# EAGLE design BareBones Arduino With Multiplexer (EAGLE 8.7.0)
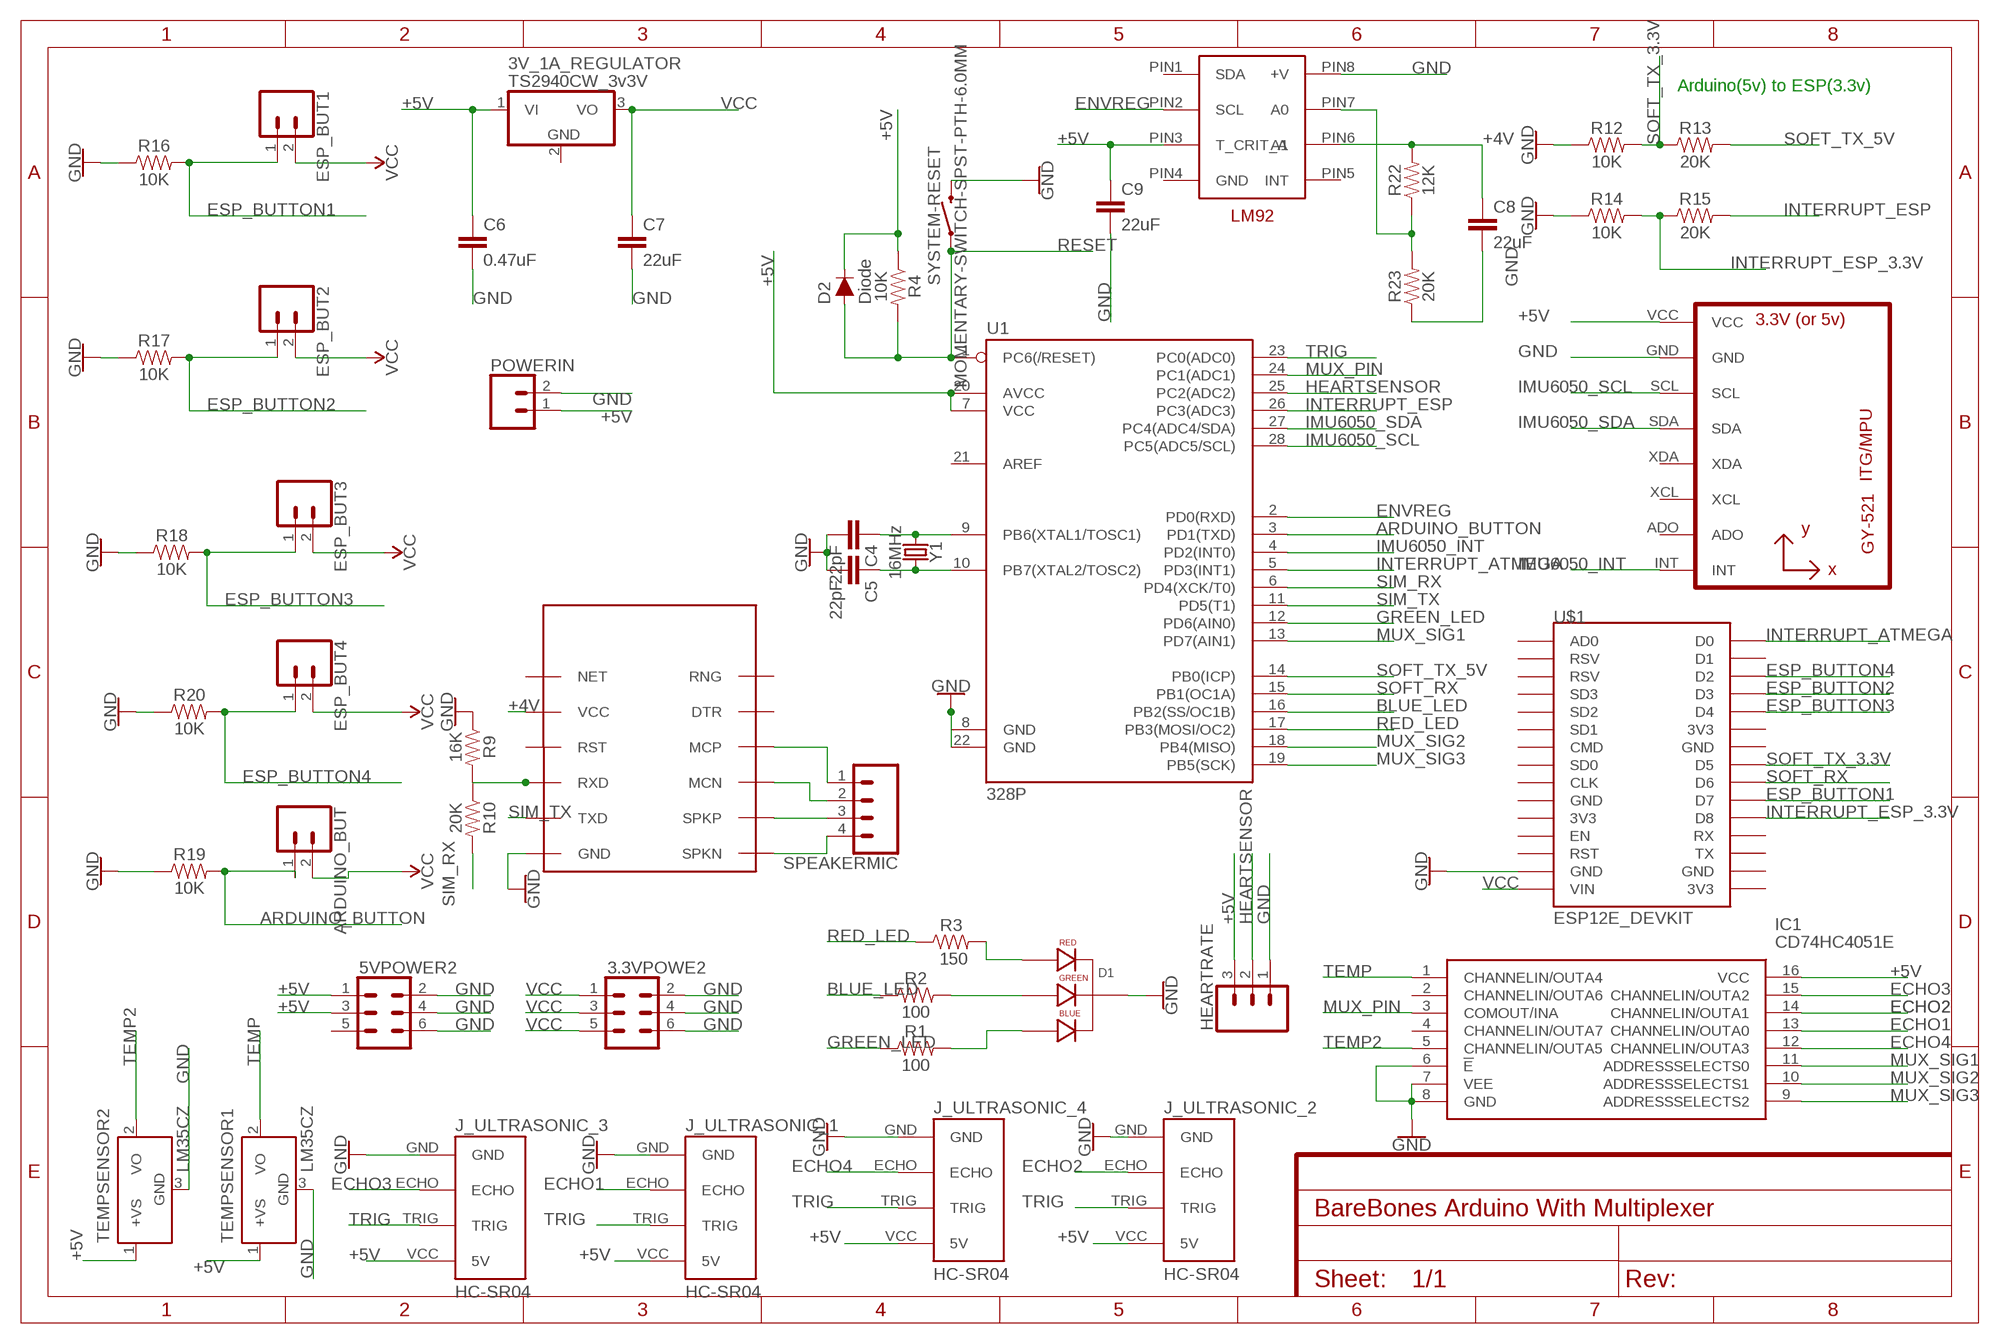
[diagram p0: schematic, sheet 1]

## Parts
3.3VPOWE2  CONN_03X2FEMALE  [2X3]
3V_1A_REGULATOR  TS2940CW_3v3V  MCP1703DB  [SOT223]
5VPOWER2  CONN_03X2FEMALE  [2X3]
ARDUINO_BUT  CONN_02  [1X02]
C4  22pF  22PF-PTH-2.54MM-200V-5%  [CAP-PTH-2.54]
C5  22pF  22PF-PTH-2.54MM-200V-5%  [CAP-PTH-2.54]
C6  0.47uF  0.1UF-KIT-EZ-50V-20%  [CAP-PTH-SMALL-KIT]
C7  22uF  0.1UF-KIT-EZ-50V-20%  [CAP-PTH-SMALL-KIT]
C8  22uF  0.1UF-KIT-EZ-50V-20%  [CAP-PTH-SMALL-KIT]
C9  22uF  0.1UF-KIT-EZ-50V-20%  [CAP-PTH-SMALL-KIT]
D1  LED-RGB-CC-THRUDIFFUSE  [LED-RGB-THRU]
D2  Diode  DIODE-1N4148  [DIODE-1N4148]
ESP_BUT1  CONN_02  [1X02]
ESP_BUT2  CONN_02  [1X02]
ESP_BUT3  CONN_02  [1X02]
ESP_BUT4  CONN_02  [1X02]
HEARTRATE  CONN_03  [1X03]
IC1  CD74HC4051E  [DIP794W53P254L1930H508Q16N]
J_ULTRASONIC_1  HC-SR04  [HC-SR04_FOOTPRINT]
J_ULTRASONIC_2  HC-SR04  [HC-SR04_FOOTPRINT]
J_ULTRASONIC_3  HC-SR04  [HC-SR04_FOOTPRINT]
J_ULTRASONIC_4  HC-SR04  [HC-SR04_FOOTPRINT]
POWERIN  CONN_025MM  [SCREWTERMINAL-5MM-2]
R1  100  100OHM-HORIZ-1/4W-1%  [AXIAL-0.3]
R2  100  100OHM-HORIZ-1/4W-1%  [AXIAL-0.3]
R3  150  RESISTORAXIAL-0.3  [AXIAL-0.3]
R4  10K  100OHM-HORIZ-1/4W-1%  [AXIAL-0.3]
R9  16K  100OHM-HORIZ-1/4W-1%  [AXIAL-0.3]
R10  20K  100OHM-HORIZ-1/4W-1%  [AXIAL-0.3]
R12  10K  100OHM-HORIZ-1/4W-1%  [AXIAL-0.3]
R13  20K  100OHM-HORIZ-1/4W-1%  [AXIAL-0.3]
R14  10K  100OHM-HORIZ-1/4W-1%  [AXIAL-0.3]
R15  20K  100OHM-HORIZ-1/4W-1%  [AXIAL-0.3]
R16  10K  100OHM-HORIZ-1/4W-1%  [AXIAL-0.3]
R17  10K  100OHM-HORIZ-1/4W-1%  [AXIAL-0.3]
R18  10K  100OHM-HORIZ-1/4W-1%  [AXIAL-0.3]
R19  10K  100OHM-HORIZ-1/4W-1%  [AXIAL-0.3]
R20  10K  100OHM-HORIZ-1/4W-1%  [AXIAL-0.3]
R22  12K  100OHM-HORIZ-1/4W-1%  [AXIAL-0.3]
R23  20K  100OHM-HORIZ-1/4W-1%  [AXIAL-0.3]
SPEAKERMIC  CONN_04  [1X04]
SYSTEM-RESET  MOMENTARY-SWITCH-SPST-PTH-6.0MM  [TACTILE_SWITCH_PTH_6.0MM]
TEMPSENSOR1  LM35CZ  [TO92]
TEMPSENSOR2  LM35CZ  [TO92]
U1  328P  ATMEGA328P_PDIP  [DIP28]
U2  GY-521MPU6050  [GY-521]
U$1  ESP12E_DEVKIT  [ESP12E_DEVKIT]
U$4  SIM800L  [SIM-CORE]
VREG  LM92  [SOP-8]
Y1  16MHz  CRYSTAL-16MHZPTH-HC49US  [HC49US]

## Nets
+4V: C8.1 R22.P$2 U$4.VCC VREG.PIN6(A1)
+5V: 3V_1A_REGULATOR.1(VI) 5VPOWER2.1 5VPOWER2.3 C6.1 C9.1 D2.C HEARTRATE.3 IC1.16(VCC) J_ULTRASONIC_1.VCC(5V) J_ULTRASONIC_2.VCC(5V) J_ULTRASONIC_3.VCC(5V) J_ULTRASONIC_4.VCC(5V) POWERIN.1 R4.P$1 TEMPSENSOR1.1(+VS) TEMPSENSOR2.1(+VS) U1.7(VCC) U1.20(AVCC) U2.VCC VREG.PIN3(T_CRIT_A)
ARDUINO_BUTTON: ARDUINO_BUT.1 R19.P$2 U1.3(PD1(TXD))
BLUE_LED: R2.P$1 U1.16(PB2(SS/OC1B))
ECHO1: IC1.13(CHANNELIN/OUTA0) J_ULTRASONIC_1.ECHO
ECHO2: IC1.14(CHANNELIN/OUTA1) J_ULTRASONIC_2.ECHO
ECHO3: IC1.15(CHANNELIN/OUTA2) J_ULTRASONIC_3.ECHO
ECHO4: IC1.12(CHANNELIN/OUTA3) J_ULTRASONIC_4.ECHO
ENVREG: U1.2(PD0(RXD)) VREG.PIN2(SCL)
ESP_BUTTON1: ESP_BUT1.1 R16.P$2 U$1.D7
ESP_BUTTON2: ESP_BUT2.1 R17.P$2 U$1.D3
ESP_BUTTON3: ESP_BUT3.1 R18.P$2 U$1.D4
ESP_BUTTON4: ESP_BUT4.1 R20.P$2 U$1.D2
GND: 3.3VPOWE2.2 3.3VPOWE2.4 3.3VPOWE2.6 5VPOWER2.2 5VPOWER2.4 5VPOWER2.6 C4.2 C5.2 C6.2 C7.2 C8.2 C9.2 D1.2(CATHODE) HEARTRATE.1 IC1.6(!E) IC1.7(VEE) IC1.8(GND) J_ULTRASONIC_1.GND J_ULTRASONIC_2.GND J_ULTRASONIC_3.GND J_ULTRASONIC_4.GND POWERIN.2 R9.P$1 R12.P$1 R14.P$1 R16.P$1 R17.P$1 R18.P$1 R19.P$1 R20.P$1 R23.P$1 SYSTEM-RESET.3 TEMPSENSOR1.3(GND) TEMPSENSOR2.3(GND) U1.8(GND) U1.22(GND) U2.GND U$1.GND@1(GND) U$4.GND VREG.PIN8(+V)
GREEN_LED: R1.P$1 U1.12(PD6(AIN0))
HEARTSENSOR: HEARTRATE.2 U1.25(PC2(ADC2))
IMU6050_INT: U1.4(PD2(INT0)) U2.INT
IMU6050_SCL: U1.28(PC5(ADC5/SCL)) U2.SCL
IMU6050_SDA: U1.27(PC4(ADC4/SDA)) U2.SDA
INTERRUPT_ATMEGA: U1.5(PD3(INT1)) U$1.D0
INTERRUPT_ESP: R15.P$2 U1.26(PC3(ADC3))
INTERRUPT_ESP_3.3V: R14.P$2 R15.P$1 U$1.D8
MUX_PIN: IC1.3(COMOUT/INA) U1.24(PC1(ADC1))
MUX_SIG1: IC1.11(ADDRESSSELECTS0) U1.13(PD7(AIN1))
MUX_SIG2: IC1.10(ADDRESSSELECTS1) U1.18(PB4(MISO))
MUX_SIG3: IC1.9(ADDRESSSELECTS2) U1.19(PB5(SCK))
N$1: C5.1 U1.10(PB7(XTAL2/TOSC2)) Y1.2
N$2: D1.1(RED_CATHODE) R3.P$2
N$3: D1.3(GREEN_CATHODE) R2.P$2
N$4: D1.4(BLUE_CATHODE) R1.P$2
N$5: SPEAKERMIC.1 U$4.MCP
N$7: SPEAKERMIC.2 U$4.MCN
N$8: C4.1 U1.9(PB6(XTAL1/TOSC1)) Y1.1
N$9: SPEAKERMIC.3 U$4.SPKP
N$10: SPEAKERMIC.4 U$4.SPKN
N$11: R9.P$2 R10.P$1 U$4.RXD
N$16: R22.P$1 R23.P$2 VREG.PIN7(A0)
RED_LED: R3.P$1 U1.17(PB3(MOSI/OC2))
RESET: D2.A R4.P$2 SYSTEM-RESET.1 U1.1(PC6(/RESET))
SIM_RX: R10.P$2 U1.6(PD4(XCK/T0))
SIM_TX: U1.11(PD5(T1)) U$4.TXD
SOFT_RX: U1.15(PB1(OC1A)) U$1.D6
SOFT_TX_3.3V: R12.P$2 R13.P$1 U$1.D5
SOFT_TX_5V: R13.P$2 U1.14(PB0(ICP))
TEMP: IC1.1(CHANNELIN/OUTA4) TEMPSENSOR1.2(VO)
TEMP2: IC1.5(CHANNELIN/OUTA5) TEMPSENSOR2.2(VO)
TRIG: J_ULTRASONIC_1.TRIG J_ULTRASONIC_2.TRIG J_ULTRASONIC_3.TRIG J_ULTRASONIC_4.TRIG U1.23(PC0(ADC0))
VCC: 3.3VPOWE2.1 3.3VPOWE2.3 3.3VPOWE2.5 3V_1A_REGULATOR.3(VO) ARDUINO_BUT.2 C7.1 ESP_BUT1.2 ESP_BUT2.2 ESP_BUT3.2 ESP_BUT4.2 U$1.VIN
Unconnected: 3V_1A_REGULATOR.2(GND) 5VPOWER2.5 IC1.2(CHANNELIN/OUTA6) IC1.4(CHANNELIN/OUTA7) U1.21(AREF) U2.ADO U2.XCL U2.XDA U$1.3V3@0(3V3) U$1.3V3@1(3V3) U$1.3V3@2(3V3) U$1.AD0 U$1.CLK U$1.CMD U$1.D1 U$1.EN U$1.GND@0(GND) U$1.GND@2(GND) U$1.GND@3(GND) U$1.RST U$1.RSV@0(RSV) U$1.RSV@1(RSV) U$1.RX U$1.SD0 U$1.SD1 U$1.SD2 U$1.SD3 U$1.TX U$4.DTR U$4.NET U$4.RNG U$4.RST VREG.PIN1(SDA) VREG.PIN4(GND) VREG.PIN5(INT)

## Notes on the sheet
- Arduino(5v) to ESP(3.3v)

## Library data of the parts
3.3VPOWE2 5VPOWER2 = SparkFun-Connectors:CONN_03X2: Multi connection point. Often used as Generic Header-pin footprint for 0.1 inch spaced/style header connections You can populate with any combo of single row headers, but if you'd like an exact match, check these: Header - 2x3 (Male, 0.1") <https://www.sparkfun.com/products/12807> (PRT-12807) Header - 2x3 (Female, 0.1") <https://www.sparkfun.com/products/13010> (PRT-13010) 2x3 Pin Shrouded Header <https://www.sparkfun.com/products/10877> (PRT-10877) On any of the 0.1 inch spaced packages, you can populate with these: Break Away Headers - Straight <https://www.sparkfun.com/products/116> (PRT-00116) Break Away Male Headers - Right Angle <https://www.sparkfun.com/products/553> (PRT-00553) Female Headers <https://www.sparkfun.com/products/115> (PRT-00115) Break Away Headers - Machine Pin <https://www.sparkfun.com/products/117> (PRT-00117) Break Away Female Headers - Swiss Machine Pin <https://www.sparkfun.com/products/743> (PRT-00743) Special note: the shrouded connector mates well with our 3x2 ribbon cables: Ribbon Crimp Connector - 6-pin (2x3, Female) <https://www.sparkfun.com/products/10651> (PRT-10651) Ribbon Cable - 6 wire (15ft) <https://www.sparkfun.com/products/10646> (PRT-10646); PROD_ID: CONN-11566; VALUE: FEMALE 2x3
3V_1A_REGULATOR = linear:MCP1703: 250 mA, 16V, Low Quiescent Current LDO Regulator Source: http://ww1.microchip.com/downloads/en/DeviceDoc/22049b.pdf
ARDUINO_BUT ESP_BUT1-ESP_BUT4 = SparkFun-Connectors:CONN_02: Multi connection point. Often used as Generic Header-pin footprint for 0.1 inch spaced/style header connections On any of the 0.1 inch spaced packages, you can populate with these: Break Away Headers - Straight <https://www.sparkfun.com/products/116> (PRT-00116) Break Away Male Headers - Right Angle <https://www.sparkfun.com/products/553> (PRT-00553) Female Headers <https://www.sparkfun.com/products/115> (PRT-00115) Break Away Headers - Machine Pin <https://www.sparkfun.com/products/117> (PRT-00117) Break Away Female Headers - Swiss Machine Pin <https://www.sparkfun.com/products/743> (PRT-00743) For SCREWTERMINALS and SPRING TERMINALS visit here: Screw Terimnals on SparkFun.com <https://www.sparkfun.com/search/results?term=Screw+Terminals> (5mm/3.5mm/2.54mm spacing) This device is also useful as a general connection point to wire up your design to another part of your project. Our various solder wires solder well into these plated through hole pads. Hook-Up Wire - Assortment (Stranded, 22 AWG) <https://www.sparkfun.com/products/11375> (PRT-11375) Hook-Up Wire - Assortment (Solid Core, 22 AWG) <https://www.sparkfun.com/products/11367> (PRT-11367) View the entire wire category on our website here <https://www.sparkfun.com/categories/141> Special notes: Molex polarized connector foot print use with: PRT-08233 with associated crimp pins and housings. 2.54_SCREWTERM for use with PRT-10571. 3.5mm Screw Terminal footprints for PRT-08084 5mm Screw Terminal footprints for use with PRT-08432
C4 C5 = SparkFun-Capacitors:22PF: 22pF ceramic capacitors A capacitor is a passive two-terminal electrical component used to store electrical energy temporarily in an electric field.; PROD_ID: CAP-09128
C6-C9 = SparkFun-Capacitors:0.1UF: 0.1µF ceramic capacitors A capacitor is a passive two-terminal electrical component used to store electrical energy temporarily in an electric field.; PROD_ID: CAP-08370; VALUE: 0.1uF
D1 = led:LED-RGB-CC-THRU: RGB Through-hole common cathode LED SparkFun Storefront: COM-00105 (Clear) COM-09264 (Diffuse); PROD_ID: DIO-09434
D2 = SparkFun-DiscreteSemi:DIODE: Diode These are standard reverse protection diodes and small signal diodes. SparkFun Products: SparkFun SparkPunk Sound Kit <https://www.sparkfun.com/products/11177> SparkFun ESP8266 Thing <https://www.sparkfun.com/products/13231>; PROD_ID: DIO-08378; VALUE: 200mA/100V/1V
HEARTRATE = SparkFun-Connectors:CONN_03: Multi connection point. Often used as Generic Header-pin footprint for 0.1 inch spaced/style header connections On any of the 0.1 inch spaced packages, you can populate with these: Break Away Headers - Straight <https://www.sparkfun.com/products/116> (PRT-00116) Break Away Male Headers - Right Angle <https://www.sparkfun.com/products/553> (PRT-00553) Female Headers <https://www.sparkfun.com/products/115> (PRT-00115) Break Away Headers - Machine Pin <https://www.sparkfun.com/products/117> (PRT-00117) Break Away Female Headers - Swiss Machine Pin <https://www.sparkfun.com/products/743> (PRT-00743) Stackable Header - 3 Pin (Female, 0.1") <https://www.sparkfun.com/products/13875> (PRT-13875) For SCREWTERMINALS and SPRING TERMINALS visit here: Screw Terimnals on SparkFun.com <https://www.sparkfun.com/search/results?term=Screw+Terminals> (5mm/3.5mm/2.54mm spacing) This device is also useful as a general connection point to wire up your design to another part of your project. Our various solder wires solder well into these plated through hole pads. Hook-Up Wire - Assortment (Stranded, 22 AWG) <https://www.sparkfun.com/products/11375> (PRT-11375) Hook-Up Wire - Assortment (Solid Core, 22 AWG) <https://www.sparkfun.com/products/11367> (PRT-11367) View the entire wire category on our website here <https://www.sparkfun.com/categories/141> Special notes: Molex polarized connector foot print use with SKU : PRT-08232 with associated crimp pins and housings.
IC1 = CD74HC4051E:CD74HC4051E: CD74HC4051E, Multiplexer/Demultiplexer Single 8:1, 3 V, 5 V, 16-Pin, PDIP, 1 Source: Datasheet <http://www.ti.com/lit/ds/symlink/cd74hc4051.pdf>; DESCRIPTION: CD74HC4051E, Multiplexer/Demultiplexer Single 8:1, 3 V, 5 V, 16-Pin, PDIP, 1; HEIGHT: 5.08mm; MANUFACTURER_NAME: Texas Instruments; MANUFACTURER_PART_NUMBER: CD74HC4051E; RS_PART_NUMBER: 2508240054; SUPPLIER_NAME: RS
J_ULTRASONIC_1-J_ULTRASONIC_4 = UltraSonic Sensor:HC-SR04: Ultrasonic Sensor HC-SR04
POWERIN = SparkFun-Connectors:CONN_02: Multi connection point. Often used as Generic Header-pin footprint for 0.1 inch spaced/style header connections On any of the 0.1 inch spaced packages, you can populate with these: Break Away Headers - Straight <https://www.sparkfun.com/products/116> (PRT-00116) Break Away Male Headers - Right Angle <https://www.sparkfun.com/products/553> (PRT-00553) Female Headers <https://www.sparkfun.com/products/115> (PRT-00115) Break Away Headers - Machine Pin <https://www.sparkfun.com/products/117> (PRT-00117) Break Away Female Headers - Swiss Machine Pin <https://www.sparkfun.com/products/743> (PRT-00743) For SCREWTERMINALS and SPRING TERMINALS visit here: Screw Terimnals on SparkFun.com <https://www.sparkfun.com/search/results?term=Screw+Terminals> (5mm/3.5mm/2.54mm spacing) This device is also useful as a general connection point to wire up your design to another part of your project. Our various solder wires solder well into these plated through hole pads. Hook-Up Wire - Assortment (Stranded, 22 AWG) <https://www.sparkfun.com/products/11375> (PRT-11375) Hook-Up Wire - Assortment (Solid Core, 22 AWG) <https://www.sparkfun.com/products/11367> (PRT-11367) View the entire wire category on our website here <https://www.sparkfun.com/categories/141> Special notes: Molex polarized connector foot print use with: PRT-08233 with associated crimp pins and housings. 2.54_SCREWTERM for use with PRT-10571. 3.5mm Screw Terminal footprints for PRT-08084 5mm Screw Terminal footprints for use with PRT-08432; SF_SKU: PRT-08432
R1 R2 = SparkFun-Resistors:100OHM: 100Ω resistor A resistor is a passive two-terminal electrical component that implements electrical resistance as a circuit element. Resistors act to reduce current flow, and, at the same time, act to lower voltage levels within circuits. - Wikipedia; PROD_ID: RES-12181
R3 = SparkFun-Resistors:RESISTOR: Generic Resistor Package
R4 R9 R10 R12-R20 R22 R23 = SparkFun-Resistors:100OHM: 100Ω resistor A resistor is a passive two-terminal electrical component that implements electrical resistance as a circuit element. Resistors act to reduce current flow, and, at the same time, act to lower voltage levels within circuits. - Wikipedia; PROD_ID: RES-12181; VALUE: 100
SPEAKERMIC = SparkFun-Connectors:CONN_04: Multi connection point. Often used as Generic Header-pin footprint for 0.1 inch spaced/style header connections On any of the 0.1 inch spaced packages, you can populate with these: Break Away Headers - Straight <https://www.sparkfun.com/products/116> (PRT-00116) Break Away Male Headers - Right Angle <https://www.sparkfun.com/products/553> (PRT-00553) Female Headers <https://www.sparkfun.com/products/115> (PRT-00115) Break Away Headers - Machine Pin <https://www.sparkfun.com/products/117> (PRT-00117) Break Away Female Headers - Swiss Machine Pin <https://www.sparkfun.com/products/743> (PRT-00743) For SCREWTERMINALS and SPRING TERMINALS visit here: Screw Terimnals on SparkFun.com <https://www.sparkfun.com/search/results?term=Screw+Terminals> (5mm/3.5mm/2.54mm spacing) This device is also useful as a general connection point to wire up your design to another part of your project. Our various solder wires solder well into these plated through hole pads. Hook-Up Wire - Assortment (Stranded, 22 AWG) <https://www.sparkfun.com/products/11375> (PRT-11375) Hook-Up Wire - Assortment (Solid Core, 22 AWG) <https://www.sparkfun.com/products/11367> (PRT-11367) View the entire wire category on our website here <https://www.sparkfun.com/categories/141> Special notes: Molex polarized connector foot print use with SKU : PRT-08231 with associated crimp pins and housings. 1MM SMD Version SKU: PRT-10208; PROD_ID: CONN-09696
SYSTEM-RESET = SparkFun-Switches:MOMENTARY-SWITCH-SPST: Momentary Switch (Pushbutton) - SPST Normally-open (NO) SPST momentary switches (buttons, pushbuttons). Variants PTH-12MM - 12mm square, through-hole Momentary Pushbutton Switch - 12mm Square <https://www.sparkfun.com/products/9190> (COM-09190) PTH-6.0MM, PTH-6.0MM-KIT - 6.0mm square, through-hole Mini Pushbutton Switch <https://www.sparkfun.com/products/97> (COM-00097) KIT package intended for soldering kit's - only one side of pads' copper is exposed. PTH-RIGHT-ANGLE-KIT - Right-angle, through-hole Right Angle Tactile Button <https://www.sparkfun.com/products/10791> - Used on SparkFun BigTime Watch Kit <https://www.sparkfun.com/products/11734> SMD-12MM - 12mm square, surface-mount Tactile Button - SMD (12mm) <https://www.sparkfun.com/products/12993> (COM-12993) Used on SparkFun PicoBoard <https://www.sparkfun.com/products/11888> SMD-4.5MM - 4.5mm Square Trackball Switch Used on SparkFun Blackberry Trackballer Breakout <https://www.sparkfun.com/products/13169> SMD-4.6MMX2.8MM - 4.60mm x 2.80mm, surface mount Used on SparkFun SAMD21 Mini Breakout <https://www.sparkfun.com/products/13664> SMD-5.2MM, SMD-5.2-REDUNDANT - 5.2mm square, surface-mount Mini Pushbutton Switch - SMD <https://www.sparkfun.com/products/8720> (COM-08720) Used on Arduino Pro Mini <https://www.sparkfun.com/products/11114> REDUNDANT package connects both switch circuits together SMD-6.0X3.5MM - 6.0 x 3.5mm, surface mount Momentary Reset Switch SMD <https://www.sparkfun.com/products/8229> (COM-08229) SMD-6.2MM-TALL - 6.2mm square, surface mount Tactile Button - SMD (6mm) <https://www.sparkfun.com/products/12992> Used on SparkFun Digital Sandbox <https://www.sparkfun.com/products/12651> SMD-RIGHT-ANGLE - Right-angle, surface mount Used on SparkFun Block for Intel® Edison - Arduino <https://www.sparkfun.com/products/13036>; PROD_ID: SWCH-08441; SF_SKU: COM-00097
TEMPSENSOR1 TEMPSENSOR2 = lm35:LM35: Single-Supply Centigrade Temperature Sensor Vout = (10mV/°C x Temp °C) +5mmmV Source: http://www.national.com/ds/LM/LM35.pdf
U1 = SparkFun-IC-Microcontroller:ATMEGA328P_PDIP: Atmel 328P Through hole ATMEGA328P uC used in the Arduino 32kb flash, 1k EEPROM, 2k SRAM Datasheet <http://www.sparkfun.com/datasheets/Components/SMD/ATMega328.pdf> SparkFun Products Storefront component: AVR 28 Pin 20MHz 32K 6A/D - ATMega328P <https://www.sparkfun.com/products/9061> (COM-09061) SparkFun Simon Says - Through-Hole Soldering Kit <https://www.sparkfun.com/products/10547> (KIT-10547) SparkFun Learn to Solder - Simon Says <https://www.sparkfun.com/products/13708> (KIT-13708) SparkFun BigTime Watch Kit <https://www.sparkfun.com/products/11734> (KIT-11734) SparkFun ClockIt <https://www.sparkfun.com/products/10930> (KIT-10930) SparkFun Serial Enabled LCD Kit <https://www.sparkfun.com/products/10097> (LCD-10097) SparkFun Simon Tilts - Through Hole Soldering Kit <https://www.sparkfun.com/products/12634> (KIT-12634) SparkFun Frequency Counter Kit <https://www.sparkfun.com/products/10140> (KIT-10140) FabFM Radio Kit <https://www.sparkfun.com/products/11043> (KIT-11043) SparkFun Binary Blaster Kit <https://www.sparkfun.com/products/12037> (KIT-12037) SparkFun Metro-Gnome <https://www.sparkfun.com/products/9236> (KIT-09236) ATmega328 with Arduino Optiboot (Uno) <https://www.sparkfun.com/products/10524> (DEV-10524); PROD_ID: IC-09136
U2 = mpu6050:GY-521
U$1 = nodeMCU:ESP12E_DEVKIT: ESP12E DEVKIT BOARD
U$4 = SIM800L2:SIM800L
VREG = smdfootprint:LM92; SPICEPREFIX: X
Y1 = SparkFun-Clocks:CRYSTAL-16MHZ: 16MHz Crystal Digikey Example <http://www.digikey.com/product-search/en?keywords=535-9122-1-ND> Frequency: 16MHz Frequency Stability: ±50ppm Frequency Tolerance: ±20ppm Load Capacitance: 18pF SparkFun Products: Pro Micro -5V/16MHz <https://www.sparkfun.com/products/12640> SparkFun Serial Enabled LCD Kit <https://www.sparkfun.com/products/10097>; PROD_ID: XTAL-08181; SF_ID: COM-00536

## Board
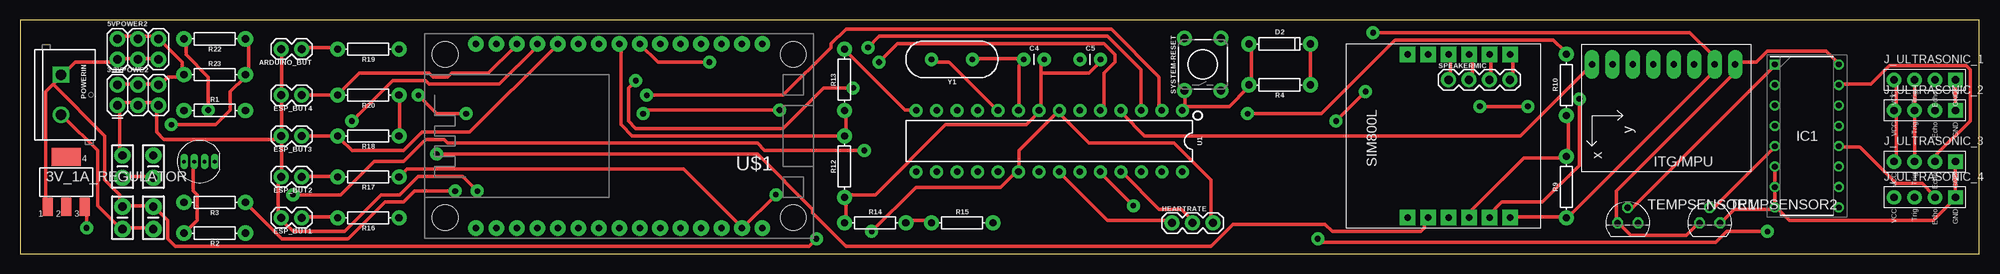
[diagram p1: board, top side]
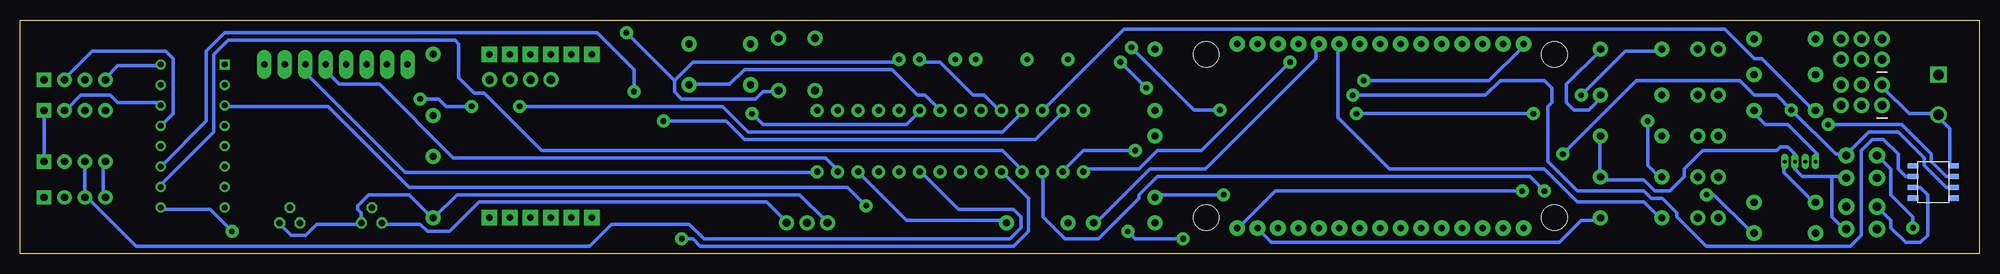
[diagram p2: board, bottom side, seen from below]

Size 243 x 29 mm. Coordinates in mm from the lower left corner, seen from the top.
Outline: 0,0 243,0 243,29 0,29 0,0
Copper layers (1*16): Top 0.035mm / dielectric 1.5mm / Bottom 0.035mm
Design rules "default *": minimum track width 18mil, minimum drill 0.7mm, track to track 18mil, track to pad 18mil, pad to pad 18mil, via to via 24mil, smd to smd 18mil, copper to edge 24mil, drill to drill 6mil, minimum pad ring 10mil, minimum via ring 18mil, stop-mask expansion 4mil, vias tented up to drill 0mil, thermal gap 16mil
vRestrict: area 2.5,6.4 to 8.9,11.4; area 109.9,11.4 to 145.4,16.5; area 217.2,5.1 to 225.4,24.1; area 1.9,14 to 9.5,25.4

### Footprints (pad centres in the part's own frame; a part is rotated, then mirrored left to right if it is on the bottom)
2X3 = drill 1.016 pad 1.88: 1 0,0; 2 0,2.54; 3 2.54,0; 4 2.54,2.54; 5 5.08,0; 6 5.08,2.54
SOT223 = smd 1.219 x 2.235: 1 -2.311,-3.099; 2 0,-3.099; 3 2.311,-3.099 | smd 3.6 x 2.2: 4 0,3.099
1X02 = drill 1.016 pad 1.88: 1 0,0; 2 2.54,0
CAP-PTH-2.54 = drill 0.7 pad 1.651: 1 -1.27,0; 2 1.27,0
CAP-PTH-SMALL-KIT = drill 1.016 pad 2.032: 1 -1.397,0; 2 1.397,0
LED-RGB-THRU = drill 0.45 pad 0.5 long: 1 1.905,0; 2 0.635,0; 3 -0.635,0; 4 -1.905,0
DIODE-1N4148 = drill 0.9 pad 1.88: A -3.81,0; C 3.81,0
1X03 = drill 1.016 pad 1.88: 1 0,0; 2 2.54,0; 3 5.08,0
DIP794W53P254L1930H508Q16N = drill 0.73 pad 1.13 square: 1 -3.97,8.89 | drill 0.73 pad 1.13: 2 -3.97,6.35; 3 -3.97,3.81; 4 -3.97,1.27; 5 -3.97,-1.27; 6 -3.97,-3.81; 7 -3.97,-6.35; 8 -3.97,-8.89; 9 3.97,-8.89; 10 3.97,-6.35; 11 3.97,-3.81; 12 3.97,-1.27; 13 3.97,1.27; 14 3.97,3.81; 15 3.97,6.35; 16 3.97,8.89
HC-SR04_FOOTPRINT = drill 0.9 pad 1.778: ECHO 0,1.27; TRIG 0,-1.27; VCC 0,-3.81 | drill 0.9 pad 1.778 square: GND 0,3.81
SCREWTERMINAL-5MM-2 = drill 1.3 pad 2.032 square: 1 0,0 | drill 1.3 pad 2.032: 2 5,0
AXIAL-0.3 = drill 0.9 pad 1.88: P$1 -3.81,0; P$2 3.81,0
1X04 = drill 1.016 pad 1.88: 1 0,0; 2 2.54,0; 3 5.08,0; 4 7.62,0
TACTILE_SWITCH_PTH_6.0MM = drill 1.016 pad 1.88: 1 -3.251,2.261; 2 3.251,2.261; 3 -3.251,-2.261; 4 3.251,-2.261
TO92 = drill 0.813 octagon: 1 -1.27,0; 2 0,1.905; 3 1.27,0
DIP28 = drill 0.813 pad 1.626: 1 -16.51,-3.81; 2 -13.97,-3.81; 3 -11.43,-3.81; 4 -8.89,-3.81; 5 -6.35,-3.81; 6 -3.81,-3.81; 7 -1.27,-3.81; 8 1.27,-3.81; 9 3.81,-3.81; 10 6.35,-3.81; 11 8.89,-3.81; 12 11.43,-3.81; 13 13.97,-3.81; 14 16.51,-3.81; 15 16.51,3.81; 16 13.97,3.81; 17 11.43,3.81; 18 8.89,3.81; 19 6.35,3.81; 20 3.81,3.81; 21 1.27,3.81; 22 -1.27,3.81; 23 -3.81,3.81; 24 -6.35,3.81; 25 -8.89,3.81; 26 -11.43,3.81; 27 -13.97,3.81; 28 -16.51,3.81
GY-521 = drill 0.8 pad 1.778 long: ADO -8.89,-6.35; GND -8.89,6.35; INT -8.89,-8.89; SCL -8.89,3.81; SDA -8.89,1.27; VCC -8.89,8.89; XCL -8.89,-3.81; XDA -8.89,-1.27
ESP12E_DEVKIT = drill 0.8 pad 1.93: 3V3@0 -11.43,-7.62; 3V3@1 11.43,5.08; 3V3@2 11.43,-17.78; AD0 -11.43,17.78; CLK -11.43,-2.54; CMD -11.43,2.54; D0 11.43,17.78; D1 11.43,15.24; D2 11.43,12.7; D3 11.43,10.16; D4 11.43,7.62; D5 11.43,0; D6 11.43,-2.54; D7 11.43,-5.08; D8 11.43,-7.62; EN -11.43,-10.16; GND@0 -11.43,-5.08; GND@1 -11.43,-15.24; GND@2 11.43,2.54; GND@3 11.43,-15.24; RST -11.43,-12.7; RSV@0 -11.43,15.24; RSV@1 -11.43,12.7; RX 11.43,-10.16; SD0 -11.43,0; SD1 -11.43,5.08; SD2 -11.43,7.62; SD3 -11.43,10.16; TX 11.43,-12.7; VIN -11.43,-17.78 | hole 3.2: -10.16,21.59; 10.16,21.59; 10.16,-21.59; -10.16,-21.59
SIM-CORE = drill 0.8 pad 1.93 square: DTR 21.59,13.97; GND 1.27,3.81; MCN 21.59,8.89; MCP 21.59,11.43; NET 1.27,16.51; RNG 21.59,16.51; RST 1.27,11.43; RXD 1.27,8.89; SPKN 21.59,3.81; SPKP 21.59,6.35; TXD 1.27,6.35; VCC 1.27,13.97
SOP-8 = smd 1.27 x 0.635: PIN1 -2.5,2; PIN2 -2.5,0.67; PIN3 -2.5,-0.67; PIN4 -2.5,-2; PIN5 2.5,-2; PIN6 2.5,-0.67; PIN7 2.5,0.67; PIN8 2.5,2
HC49US = drill 0.7 pad 1.651: 1 -2.54,0; 2 2.54,0

### Placement (x,y rotation side)
3.3VPOWE2  12.06,18.41 0 top
3V_1A_REGULATOR  5.71,8.89 0 top
5VPOWER2  12.06,24.13 0 top
ARDUINO_BUT  34.92,25.4 180 top
C4  125.73,24.13 0 top
C5  132.72,24.13 0 top
C6  12.7,4.45 270 top
C7  12.7,10.79 270 top
C8  16.51,10.79 270 top
C9  16.51,4.45 270 top
D1  22.23,11.43 0 top
D2  156.21,26.04 0 top
ESP_BUT1  34.92,4.45 180 top
ESP_BUT2  34.92,9.53 180 top
ESP_BUT3  34.92,14.61 180 top
ESP_BUT4  34.92,19.68 180 top
HEARTRATE  142.88,3.81 0 top
IC1  221.62,14.61 0 top
J_ULTRASONIC_1  236.22,21.59 270 top
J_ULTRASONIC_2  236.22,17.78 270 top
J_ULTRASONIC_3  236.22,11.43 270 top
J_ULTRASONIC_4  236.22,6.99 270 top
POWERIN  5.08,22.23 270 top
R1  24.13,17.78 0 top
R2  24.13,2.54 180 top
R3  24.13,6.35 180 top
R4  156.21,20.95 180 top
R9  191.77,8.26 90 top
R10  191.77,20.95 90 top
R12  102.23,10.79 90 top
R13  102.23,21.59 90 top
R14  106.05,3.81 0 top
R15  116.84,3.81 0 top
R16  43.18,4.45 180 top
R17  43.18,9.53 180 top
R18  43.18,14.61 180 top
R19  43.18,25.4 180 top
R20  43.18,19.68 180 top
R22  24.13,26.67 180 top
R23  24.13,22.23 0 top
SPEAKERMIC  177.16,21.59 0 top
SYSTEM-RESET  146.69,23.5 90 top
TEMPSENSOR1  199.39,3.81 0 top
TEMPSENSOR2  209.55,3.81 0 top
U1  127.64,13.97 180 top
U2  203.84,14.61 270 top
U$1  74.3,14.61 90 top
U$4  188.59,3.17 90 top
VREG  5.71,8.89 0 bottom
Y1  115.57,24.13 180 top

### Tracks (layer width: path | path; a pad name or v marks a point on that pad's centre or on a via)
+4V  (via drill 0.7)
  Top 0.457: v23.32,17.83 23.32,21.95 20.57,24.69 20.57,26.52 R22.P$2 | v51.66,12.34 91.44,12.34 98.3,5.49 98.3,5.03 102.41,0.91 147.68,0.91 150.42,3.66 161.85,3.66 162.76,2.74 173.74,2.74 174.19,3.2 174.19,4.12 U$4.VCC
  Bottom 0.457: VREG.PIN6 3.66,8.23 4.12,8.23 6.86,10.97 6.86,11.89 10.06,15.09 13.72,15.09 16.46,12.34 C8.1 16.92,12.34 17.83,12.34 v23.32,17.83 25.15,19.66 27.89,19.66 29.72,21.49 42.52,21.49 v51.66,12.34
+5V  (via drill 0.7)
  Top 0.457: TEMPSENSOR2.1 208.03,3.66 206.65,2.29 199.8,2.29 198.43,3.66 TEMPSENSOR1.1 197.97,4.12 197.97,7.77 212.6,22.4 212.6,23.32 U2.VCC 213.06,23.77 215.34,23.77 216.71,25.15 224.03,25.15 225.4,23.77 IC1.16 | J_ULTRASONIC_1.VCC 232.72,21.49 232.72,17.83 J_ULTRASONIC_2.VCC 232.72,17.37 232.72,11.43 J_ULTRASONIC_3.VCC | 16.92,24.23 14.63,24.23 5VPOWER2.3 14.17,24.23 12.34,24.23 5VPOWER2.1 11.89,23.77 6.86,23.77 5.49,22.4 POWERIN.1 5.03,21.95 4.12,21.03 | 4.12,21.03 3.2,20.12 3.2,5.94 3V_1A_REGULATOR.1 | 4.12,21.03 10.52,14.63 10.52,9.14 12.34,7.32 12.34,5.94 C6.1 12.8,5.94 16.46,5.94 C9.1 16.92,5.49 18.29,4.12 18.29,1.83 19.2,0.91 97.84,0.91 v98.75,1.83 | D2.C R4.P$1 | HEARTRATE.3 147.68,4.12 147.68,9.14 143.1,13.72 132.59,13.72 128.93,17.37 U1.7 128.47,17.37 123.9,12.8 123.9,10.52 U1.20 123.44,10.06 121.61,8.23 111.1,8.23 v105.61,2.74
  Bottom 0.457: J_ULTRASONIC_4.VCC 232.72,7.32 232.72,11.43 J_ULTRASONIC_3.VCC | IC1.16 225.86,23.32 230.89,23.32 232.26,21.95 J_ULTRASONIC_1.VCC | C6.1 10.97,4.12 10.97,3.2 9.14,1.37 7.32,1.37 6.4,2.29 6.4,7.32 7.32,8.23 7.77,8.23 VREG.PIN3 | R4.P$1 160.02,21.03 154.99,21.03 153.16,22.86 134.87,22.86 131.67,19.66 130.76,19.66 128.93,17.83 U1.7 | v98.75,1.83 104.7,1.83 v105.61,2.74 | TEMPSENSOR1.1 197.97,3.66 193.4,3.66 192.48,2.74 189.74,2.74 186.08,6.4 150.42,6.4 148.13,4.12 HEARTRATE.3
ARDUINO_BUTTON  (via drill 0.7)
  Top 0.457: v105.16,25.6 106.53,26.98 134.87,26.98 138.99,22.86 138.99,17.83 U1.3 | v94.18,17.83 77.72,17.83 v77.27,17.37 | v55.32,17.37 51.66,17.37 v49.38,19.66 | ARDUINO_BUT.1 35.2,25.6 39.32,25.6 R19.P$2
  Bottom 0.457: v105.16,25.6 97.38,17.83 v94.18,17.83 | v55.32,17.37 v77.27,17.37 | v49.38,19.66 43.89,25.15 39.78,25.15 R19.P$2
BLUE_LED  (via drill 0.7)
  Top 0.457: v104.7,12.8 92.35,12.8 91.44,13.72 53.03,13.72 52.58,14.17 50.29,14.17 47.55,11.43 43.89,11.43 39.78,7.32 v33.83,7.32
  Bottom 0.457: v104.7,12.8 111.1,12.8 113.39,10.52 U1.16 | v33.83,7.32 32.92,7.32 28.35,2.74 R2.P$1
ECHO1
  Bottom 0.457: IC1.13 225.4,16 224.03,17.37 224.03,24.23 224.94,25.15 234.09,25.15 237.29,21.95 J_ULTRASONIC_1.ECHO
ECHO2
  Bottom 0.457: IC1.14 225.86,18.75 230.89,18.75 231.8,19.66 235.46,19.66 237.29,17.83 J_ULTRASONIC_2.ECHO
ECHO3
  Top 0.457: IC1.15 225.86,21.03 229.51,21.03 231.8,23.32 241.4,23.32 241.86,22.86 241.86,16.46 237.74,12.34 237.74,11.43 J_ULTRASONIC_3.ECHO
ECHO4
  Top 0.457: IC1.12 225.86,13.26 228.14,13.26 232.72,8.69 235.91,8.69 237.29,7.32 J_ULTRASONIC_4.ECHO
ENVREG  (via drill 0.7)
  Top 0.457: v77.72,19.66 94.64,19.66 100.58,25.6 100.58,26.06 102.41,27.89 135.33,27.89 141.28,21.95 141.28,17.83 U1.2
  Bottom 0.457: v77.72,19.66 61.27,19.66 59.44,21.49 53.95,21.49 53.03,20.57 53.03,18.75 53.49,18.29 53.49,11.43 49.84,7.77 41.6,7.77 40.69,6.86 39.32,6.86 37.49,5.03 37.49,4.57 33.83,0.91 16,0.91 14.63,2.29 14.63,12.8 13.26,14.17 11.89,14.17 10.06,12.34 10.06,10.52 9.14,9.6 8.23,9.6 VREG.PIN2
ESP_BUTTON1
  Top 0.457: ESP_BUT1.1 35.2,4.57 39.32,4.57 R16.P$2
  Bottom 0.457: U$1.D7 79.55,25.6 79.55,16.92 73.15,10.52 53.95,10.52 49.84,6.4 41.6,6.4 39.78,4.57 R16.P$2
ESP_BUTTON2  (via drill 0.7)
  Top 0.457: ESP_BUT2.1 35.2,9.6 39.32,9.6 R17.P$2 | v41.15,16.46 46.18,21.49 50.29,21.49 50.75,21.03 59.44,21.03 64.01,25.6 U$1.D3
  Bottom 0.457: v41.15,16.46 41.15,10.97 39.78,9.6 R17.P$2
ESP_BUTTON3
  Top 0.457: ESP_BUT3.1 35.2,14.63 39.32,14.63 R18.P$2 39.78,14.17 41.15,12.8 47.55,12.8 49.84,15.09 55.78,15.09 66.29,25.6 U$1.D4
ESP_BUTTON4
  Top 0.457: ESP_BUT4.1 35.2,19.66 39.32,19.66 R20.P$2 39.78,20.12 42.06,22.4 50.75,22.4 51.21,21.95 53.03,21.95 53.49,22.4 58.06,22.4 61.27,25.6 U$1.D2
GND  (via drill 0.7)
  Top 0.457: J_ULTRASONIC_1.GND J_ULTRASONIC_2.GND | J_ULTRASONIC_3.GND J_ULTRASONIC_4.GND 240.03,6.86 237.29,4.12 219.46,4.12 218.08,5.49 IC1.8 | IC1.8 217.63,5.94 217.63,8.23 IC1.7 217.63,8.69 217.63,10.52 IC1.6 | IC1.8 217.63,5.49 212.6,5.49 211.23,4.12 TEMPSENSOR2.3 | U1.22 128.93,10.06 134.87,4.12 142.65,4.12 HEARTRATE.1 | U$4.GND 185.17,4.57 191.57,4.57 R9.P$1 192.02,4.57 209.85,22.4 209.85,23.32 U2.GND 209.85,23.77 209.85,24.69 207.11,27.43 v167.79,27.43 | R14.P$1 102.41,4.12 102.41,6.86 R12.P$1 102.41,7.32 106.07,7.32 114.76,16 124.82,16 126.19,17.37 U1.8 126.64,17.83 126.64,22.4 | 126.64,22.4 126.64,23.77 C4.2 | 126.64,22.4 132.59,22.4 133.96,23.77 C5.2 | R20.P$1 47.09,19.66 47.09,14.63 R18.P$1 | C9.2 16.46,3.2 12.8,3.2 C6.2 12.34,3.2 9.6,5.94 9.6,12.8 5.49,16.92 POWERIN.2 | C7.2 12.8,9.6 16.46,9.6 C8.2 | 5VPOWER2.2 12.34,26.98 14.17,26.98 5VPOWER2.4 14.63,26.98 16.92,26.98 5VPOWER2.6 17.37,26.52 20.12,23.77 20.12,22.4 R23.P$1 20.12,21.95 18.29,21.95 17.37,21.03 3.3VPOWE2.6 16.92,21.03 14.63,21.03 3.3VPOWE2.4 14.17,21.03 12.34,21.03 3.3VPOWE2.2 | R17.P$1 47.09,9.6 48.01,10.52 82.3,10.52 89.15,3.66 89.15,3.2 U$1.GND@1 89.61,3.2 v93.73,7.32
  Bottom 0.457: J_ULTRASONIC_3.GND J_ULTRASONIC_2.GND | TEMPSENSOR2.3 210.77,3.66 209.4,2.29 207.57,2.29 206.2,3.66 200.71,3.66 TEMPSENSOR1.3 200.71,4.12 200.71,5.03 201.17,5.49 201.17,5.94 199.8,7.32 194.77,7.32 192.02,4.57 R9.P$1 191.57,4.57 188.82,7.32 146.3,7.32 143.1,4.12 HEARTRATE.1 | 161.85,21.49 161.85,20.12 160.93,19.2 151.79,19.2 150.88,20.12 149.05,20.12 SYSTEM-RESET.3 | 161.85,21.49 159.56,23.77 134.42,23.77 C5.2 | R16.P$1 47.09,4.12 49.38,4.12 52.12,1.37 87.78,1.37 89.15,2.74 U$1.GND@1 | R18.P$1 47.09,14.17 47.09,9.6 R17.P$1 46.63,9.14 41.6,9.14 40.23,7.77 38.41,7.77 36.58,9.6 36.58,10.52 34.29,12.8 25.15,12.8 24.69,13.26 23.77,13.26 22.86,12.34 D1.2 22.86,10.52 21.95,9.6 18.29,9.6 | R19.P$1 47.09,25.15 51.21,21.03 51.21,18.75 50.29,17.83 48.46,17.83 46.63,19.66 R20.P$1 | 18.29,9.6 16.92,9.6 C8.2 | 18.29,9.6 18.29,4.57 16.92,3.2 C9.2 | VREG.PIN8 3.66,10.97 3.66,15.54 5.03,16.92 POWERIN.2 5.49,17.37 8.69,17.37 11.89,20.57 3.3VPOWE2.2 | v93.73,7.32 101.96,7.32 R12.P$1 | 161.85,21.49 v167.79,27.43
GREEN_LED
  Bottom 0.457: U1.12 116.13,17.83 106.07,27.89 31.55,27.89 27.89,24.23 26.98,24.23 20.57,17.83 R1.P$1
HEARTSENSOR
  Top 0.457: U1.25 136.7,10.06 141.28,5.49 144.02,5.49 145.39,4.12 HEARTRATE.2
IMU6050_INT
  Top 0.457: U2.INT 186.08,14.63 139.45,14.63 136.7,17.37 U1.4
IMU6050_SCL
  Bottom 0.457: U1.28 144.47,10.06 195.22,10.06 207.57,22.4 207.57,23.32 U2.SCL
IMU6050_SDA
  Bottom 0.457: U1.27 141.73,10.52 143.1,11.89 189.28,11.89 198.43,21.03 203.45,21.03 204.83,22.4 204.83,23.32 U2.SDA
INTERRUPT_ATMEGA  (via drill 0.7)
  Top 0.457: v106.53,23.77 108.81,26.06 134.42,26.06 135.79,24.69 135.79,23.77 134.42,22.4 134.42,17.83 U1.5 | v103.33,20.57 99.67,20.57 94.64,15.54 76.35,15.54 75.44,16.46 75.44,20.57 v76.35,21.49
  Bottom 0.457: v103.33,20.57 v106.53,23.77 | v76.35,21.49 60.81,21.49 56.69,25.6 U$1.D0
INTERRUPT_ESP
  Bottom 0.457: U1.26 138.99,10.06 133.04,4.12 120.7,4.12 R15.P$2
INTERRUPT_ESP_3.3V
  Top 0.457: R14.P$2 110.19,4.12 112.93,4.12 R15.P$1
  Bottom 0.457: U$1.D8 82.3,25.6 82.3,24.23 96.01,10.52 102.87,10.52 109.73,3.66 R14.P$2
MUX_PIN  (via drill 0.7)
  Top 0.457: v138.07,5.94 133.96,10.06 U1.24
  Bottom 0.457: v138.07,5.94 140.36,8.23 194.77,8.23 204.83,18.29 217.63,18.29 IC1.3
MUX_SIG1  (via drill 0.7)
  Top 0.457: v163.22,16.46 v166.88,20.12
  Bottom 0.457: v166.88,20.12 166.88,22.86 171.45,27.43 217.63,27.43 219.91,25.15 219.91,16.46 225.4,10.97 IC1.11 | v163.22,16.46 155.45,16.46 153.16,14.17 117.04,14.17 113.84,17.37 U1.13
MUX_SIG2
  Bottom 0.457: IC1.10 225.4,8.69 219,15.09 219,24.69 217.17,26.52 189.08,26.52 188.59,26.04 188.59,21.84 186.69,19.93 185.44,19.93 178.31,12.8 121.16,12.8 118.87,10.52 U1.18
MUX_SIG3  (via drill 0.7)
  Top 0.457: v216.71,2.74 211.68,2.74 210.31,1.37 161.39,1.37 v160.93,1.83
  Bottom 0.457: v216.71,2.74 219.46,5.49 225.4,5.49 IC1.9 | v160.93,1.83 159.56,1.83 158.65,0.91 119.79,0.91 117.96,2.74 117.96,6.86 121.16,10.06 U1.19
N$1
  Top 0.457: U1.10 121.16,17.83 115.21,23.77 113.39,23.77 Y1.2
  Bottom 0.457: C5.1 131.22,23.77 128.93,23.77 124.82,19.66 123.44,19.66 121.61,17.83 U1.10
N$2
  Bottom 0.457: D1.1 24.23,11.43 24.23,10.06 20.57,6.4 R3.P$2
N$3
  Top 0.457: D1.3 21.49,11.43 21.49,7.77 21.95,7.32 21.95,4.12 20.57,2.74 R2.P$2
N$4
  Bottom 0.457: D1.4 20.12,11.43 20.12,12.34 23.77,16 26.52,16 27.89,17.37 R1.P$2
N$5
  Top 0.457: SPEAKERMIC.1 177.39,21.95 177.39,24.69 U$4.MCP
N$7
  Top 0.457: SPEAKERMIC.2 180.14,21.95 180.14,24.69 U$4.MCN
N$8
  Top 0.457: U1.9 123.9,17.83 123.9,23.32 124.36,23.77 C4.1 124.36,24.23 118.42,24.23 Y1.1
N$9
  Top 0.457: SPEAKERMIC.3 182.42,21.95 182.42,24.69 U$4.SPKP
N$10
  Top 0.457: SPEAKERMIC.4 185.17,21.95 185.17,24.69 U$4.SPKN
N$11
  Top 0.457: R10.P$1 192.02,16.92 192.02,12.34 R9.P$2 191.57,11.89 186.54,11.89 180.14,5.49 180.14,4.57 U$4.RXD
N$16  (via drill 0.7)
  Top 0.457: v18.75,16 24.23,16 26.06,17.83 26.06,20.12 27.89,21.95 R23.P$2 28.35,22.4 28.35,26.52 R22.P$1
  Bottom 0.457: v18.75,16 9.6,16 5.94,12.34 5.94,11.43 4.12,9.6 3.66,9.6 VREG.PIN7
RED_LED  (via drill 0.7)
  Top 0.457: v53.95,7.77 48.92,7.77 47.55,6.4 45.26,6.4 40.69,1.83 32.46,1.83 R3.P$1
  Bottom 0.457: v53.95,7.77 55.78,9.6 101.96,9.6 104.24,7.32 104.24,6.86 109.27,1.83 113.39,1.83 116.13,4.57 116.13,10.06 U1.17
RESET
  Top 0.457: 144.47,18.29 144.47,20.12 SYSTEM-RESET.1 | 144.47,18.29 144.47,17.83 U1.1 144.47,18.29 | D2.A 152.71,25.6 152.71,21.03 R4.P$2 152.25,20.57 149.96,18.29 144.47,18.29
SIM_RX  (via drill 0.7)
  Top 0.457: v152.25,17.37 161.39,17.37 170.54,26.52 190.19,26.52 191.57,25.15 R10.P$2
  Bottom 0.457: v152.25,17.37 150.88,16 133.04,16 131.67,17.37 U1.6
SIM_TX  (via drill 0.7)
  Top 0.457: v187,18.29 v181.05,18.29 | v193.4,19.2 193.4,10.97 188.82,6.4 183.79,6.4 181.97,4.57 U$4.TXD
  Bottom 0.457: v181.05,18.29 155.91,18.29 152.71,15.09 121.16,15.09 118.87,17.37 U1.11 | v187,18.29 190.19,18.29 191.11,19.2 v193.4,19.2
SOFT_RX  (via drill 0.7)
  Top 0.457: v85.5,23.77 79.1,23.77 U$1.D6
  Bottom 0.457: v85.5,23.77 96.47,12.8 101.96,12.8 104.24,10.52 111.1,10.52 U1.15
SOFT_TX_3.3V
  Top 0.457: R13.P$1 102.41,17.37 102.41,14.63 R12.P$2 101.96,14.63 75.89,14.63 74.52,16 74.52,25.6 U$1.D5
SOFT_TX_5V
  Top 0.457: U1.14 111.1,17.83 109.73,17.83 102.41,25.15 R13.P$2
TEMP
  Top 0.457: IC1.1 217.63,23.32 199.8,5.49 TEMPSENSOR1.2
TEMP2
  Top 0.457: IC1.5 217.63,13.26 209.85,5.49 TEMPSENSOR2.2
TRIG
  Top 0.457: J_ULTRASONIC_1.TRIG 235,21.49 235,17.83 J_ULTRASONIC_2.TRIG 235,17.37 235,11.43 J_ULTRASONIC_3.TRIG
  Bottom 0.457: U1.23 131.22,10.06 126.64,5.49 119.79,5.49 118.87,4.57 118.87,3.2 120.24,1.83 158.19,1.83 160.02,3.66 169.62,3.66 172.36,0.91 228.6,0.91 234.54,6.86 J_ULTRASONIC_4.TRIG 235,7.32 235,11.43 J_ULTRASONIC_3.TRIG
VCC  (via drill 0.7)
  Top 0.457: v8.23,3.2 8.23,5.49 3V_1A_REGULATOR.3 | C7.1 12.34,12.34 12.34,18.29 3.3VPOWE2.1 12.34,18.75 14.17,18.75 3.3VPOWE2.3 14.63,18.75 16.92,18.75 3.3VPOWE2.5 16.92,18.29 16.92,15.09 17.83,14.17 32,14.17 ESP_BUT3.2 | ESP_BUT3.2 32.46,14.17 32.46,9.6 ESP_BUT2.2 32,9.14 32,4.57 ESP_BUT1.2 32.46,4.12 33.83,2.74 40.23,2.74 44.81,7.32 47.09,7.32 49.38,9.6 54.86,9.6 v56.69,7.77 | ESP_BUT3.2 32.46,14.63 32.46,19.66 ESP_BUT4.2 32.46,20.12 32.46,25.15 ARDUINO_BUT.2
  Bottom 0.457: v8.23,3.2 8.23,4.57 10.97,7.32 10.97,10.52 12.34,11.89 C7.1 | v56.69,7.77 87.33,7.77 91.9,3.2 U$1.VIN